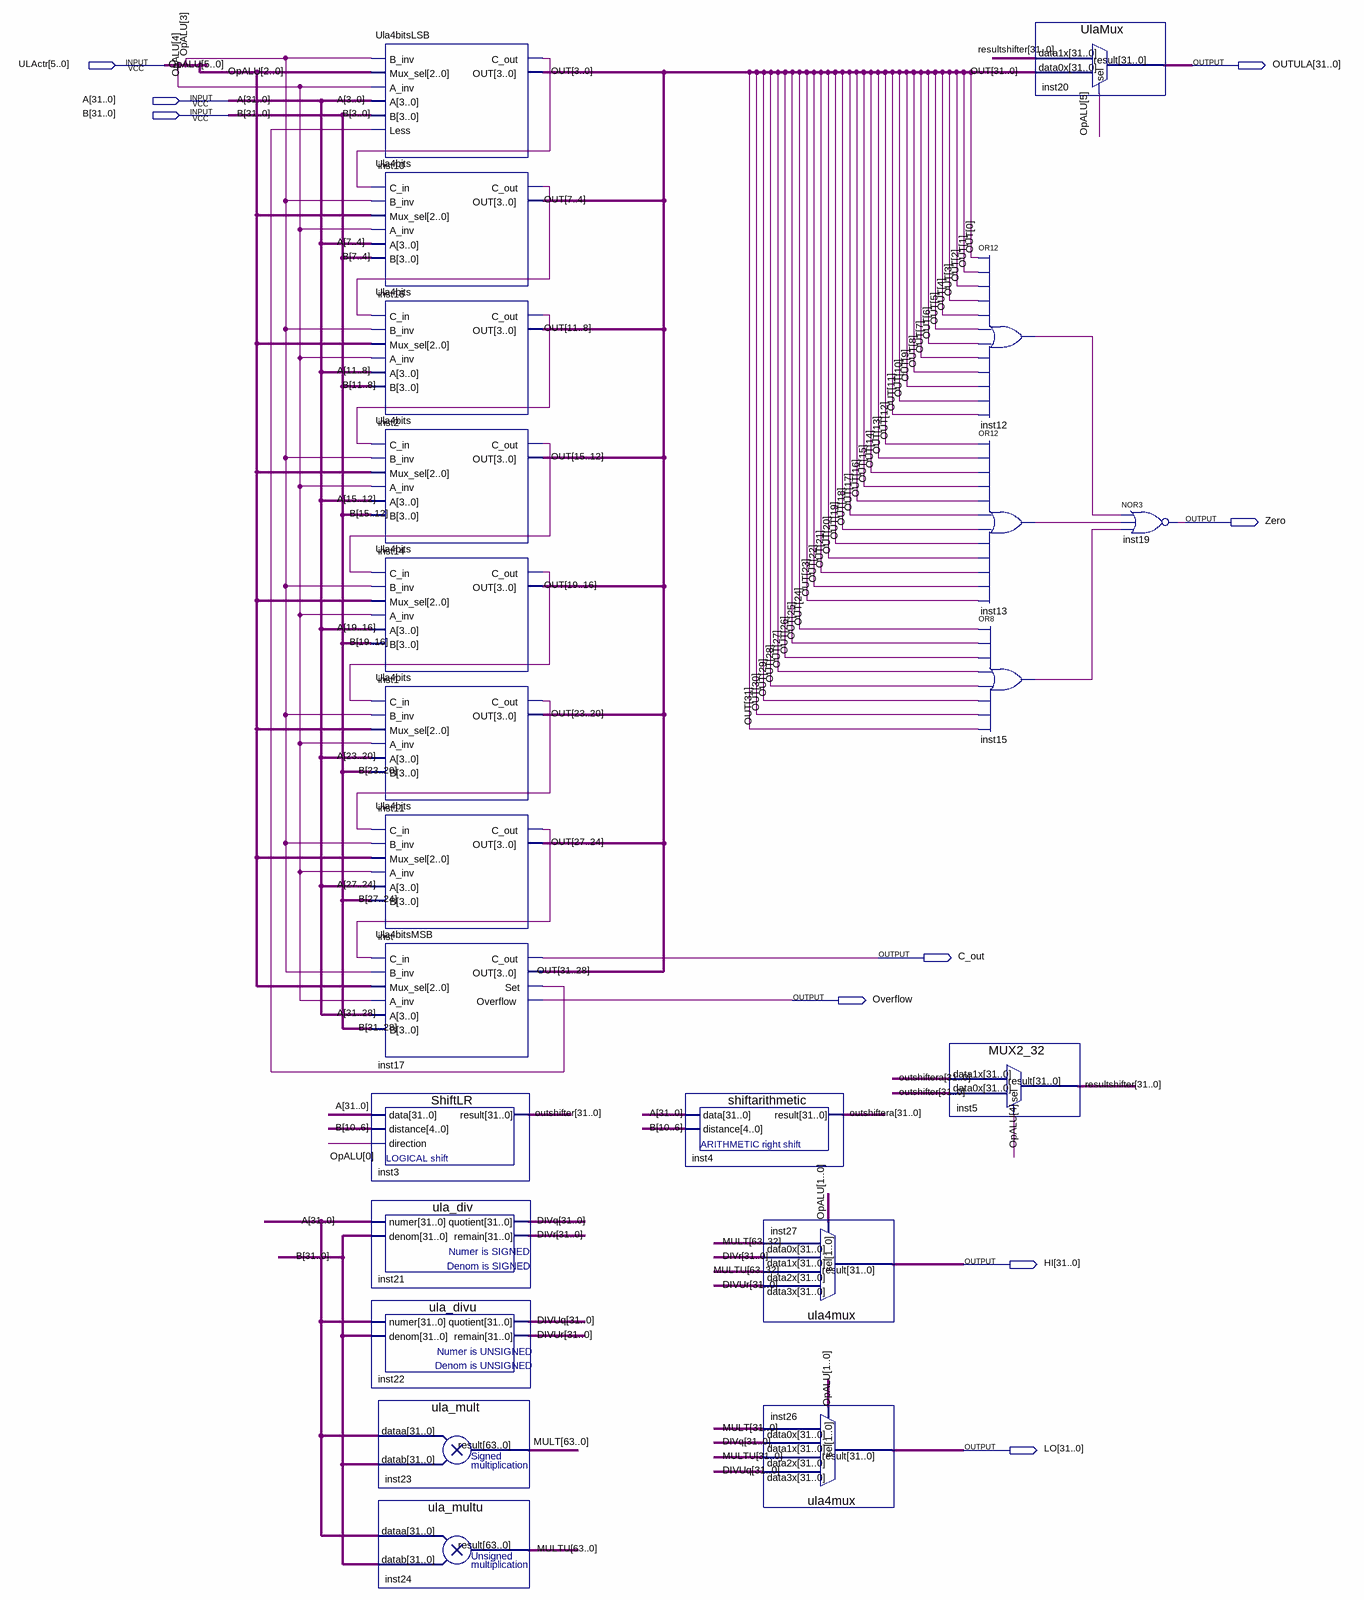
[diagram p0: schematic sheet]
// Quartus schematic ULA2.bdf as structural Verilog: 22 symbols, 9 pins
module ULA2 (
  input  [5:0] ULActr,
  input  [31:0] A,
  input  [31:0] B,
  output [31:0] OUTULA,
  output Zero,
  output C_out,
  output Overflow,
  output [31:0] HI,
  output [31:0] LO
);

  wire inst1_c_out, inst2_c_out, inst10_c_out, inst11_c_out, inst12_out, inst13_out, inst14_c_out,
       inst15_out, inst16_c_out, inst17_set, inst_c_out;
  wire [31:0] DIVq, DIVr, DIVUq, DIVUr, OUT, outshifter, outshiftera, resultshifter;
  wire [63:0] MULT, MULTU;

  Ula4bitsLSB inst10 (
    .B_inv(ULActr[3]), .Mux_sel(ULActr[2:0]), .A_inv(ULActr[4]), .A(A[3:0]), .B(B[3:0]), .Less(inst17_set),
    .C_out(inst10_c_out), .OUT(OUT[3:0]));
  Ula4bits inst16 (
    .C_in(inst10_c_out), .B_inv(ULActr[3]), .Mux_sel(ULActr[2:0]), .A_inv(ULActr[4]), .A(A[7:4]), .B(B[7:4]),
    .C_out(inst16_c_out), .OUT(OUT[7:4]));
  Ula4bits inst2 (
    .C_in(inst16_c_out), .B_inv(ULActr[3]), .Mux_sel(ULActr[2:0]), .A_inv(ULActr[4]), .A(A[11:8]),
    .B(B[11:8]), .C_out(inst2_c_out), .OUT(OUT[11:8]));
  Ula4bits inst14 (
    .C_in(inst2_c_out), .B_inv(ULActr[3]), .Mux_sel(ULActr[2:0]), .A_inv(ULActr[4]), .A(A[15:12]),
    .B(B[15:12]), .C_out(inst14_c_out), .OUT(OUT[15:12]));
  Ula4bits inst1 (
    .C_in(inst14_c_out), .B_inv(ULActr[3]), .Mux_sel(ULActr[2:0]), .A_inv(ULActr[4]), .A(A[19:16]),
    .B(B[19:16]), .C_out(inst1_c_out), .OUT(OUT[19:16]));
  Ula4bits inst11 (
    .C_in(inst1_c_out), .B_inv(ULActr[3]), .Mux_sel(ULActr[2:0]), .A_inv(ULActr[4]), .A(A[23:20]),
    .B(B[23:20]), .C_out(inst11_c_out), .OUT(OUT[23:20]));
  Ula4bits inst (
    .C_in(inst11_c_out), .B_inv(ULActr[3]), .Mux_sel(ULActr[2:0]), .A_inv(ULActr[4]), .A(A[27:24]),
    .B(B[27:24]), .C_out(inst_c_out), .OUT(OUT[27:24]));
  Ula4bitsMSB inst17 (
    .C_in(inst_c_out), .B_inv(ULActr[3]), .Mux_sel(ULActr[2:0]), .A_inv(ULActr[4]), .A(A[31:28]),
    .B(B[31:28]), .C_out(C_out), .OUT(OUT[31:28]), .Set(inst17_set), .Overflow(Overflow));
  ShiftLR inst3 (.data(A), .distance(B[10:6]), .direction(ULActr[0]), .result(outshifter));
  ula_div inst21 (.numer(A), .denom(B), .quotient(DIVq), .remain(DIVr));
  ula_divu inst22 (.numer(A), .denom(B), .quotient(DIVUq), .remain(DIVUr));
  ula_mult inst23 (.dataa(A), .datab(B), .result(MULT));
  ula_multu inst24 (.dataa(A), .datab(B), .result(MULTU));
  shiftarithmetic inst4 (.data(A), .distance(B[10:6]), .result(outshiftera));
  ula4mux inst27 (
    .data3x(DIVUr), .data2x(MULTU[63:32]), .data1x(DIVr), .data0x(MULT[63:32]), .sel(ULActr[1:0]), .result(HI));
  ula4mux inst26 (
    .data3x(DIVUq), .data2x(MULTU[31:0]), .data1x(DIVq), .data0x(MULT[31:0]), .sel(ULActr[1:0]), .result(LO));
  MUX2_32 inst5 (.data1x(outshiftera), .data0x(outshifter), .sel(ULActr[4]), .result(resultshifter));
  or inst12 (inst12_out, OUT[0], OUT[1], OUT[2], OUT[3], OUT[4], OUT[5], OUT[6], OUT[7], OUT[8], OUT[9], OUT[10], OUT[11]);
  or inst13 (inst13_out, OUT[12], OUT[13], OUT[14], OUT[15], OUT[16], OUT[17], OUT[18], OUT[19], OUT[20], OUT[21], OUT[22], OUT[23]);
  or inst15 (inst15_out, OUT[24], OUT[25], OUT[26], OUT[27], OUT[28], OUT[29], OUT[30], OUT[31]);
  UlaMux inst20 (.data1x(resultshifter), .data0x(OUT), .sel(ULActr[5]), .result(OUTULA));
  nor inst19 (Zero, inst12_out, inst13_out, inst15_out);

  // Other names for the same wires on the sheet: OpALU[5:0] = ULActr
endmodule
